# Altium project FABLAB_BADGE_00.PrjPcb
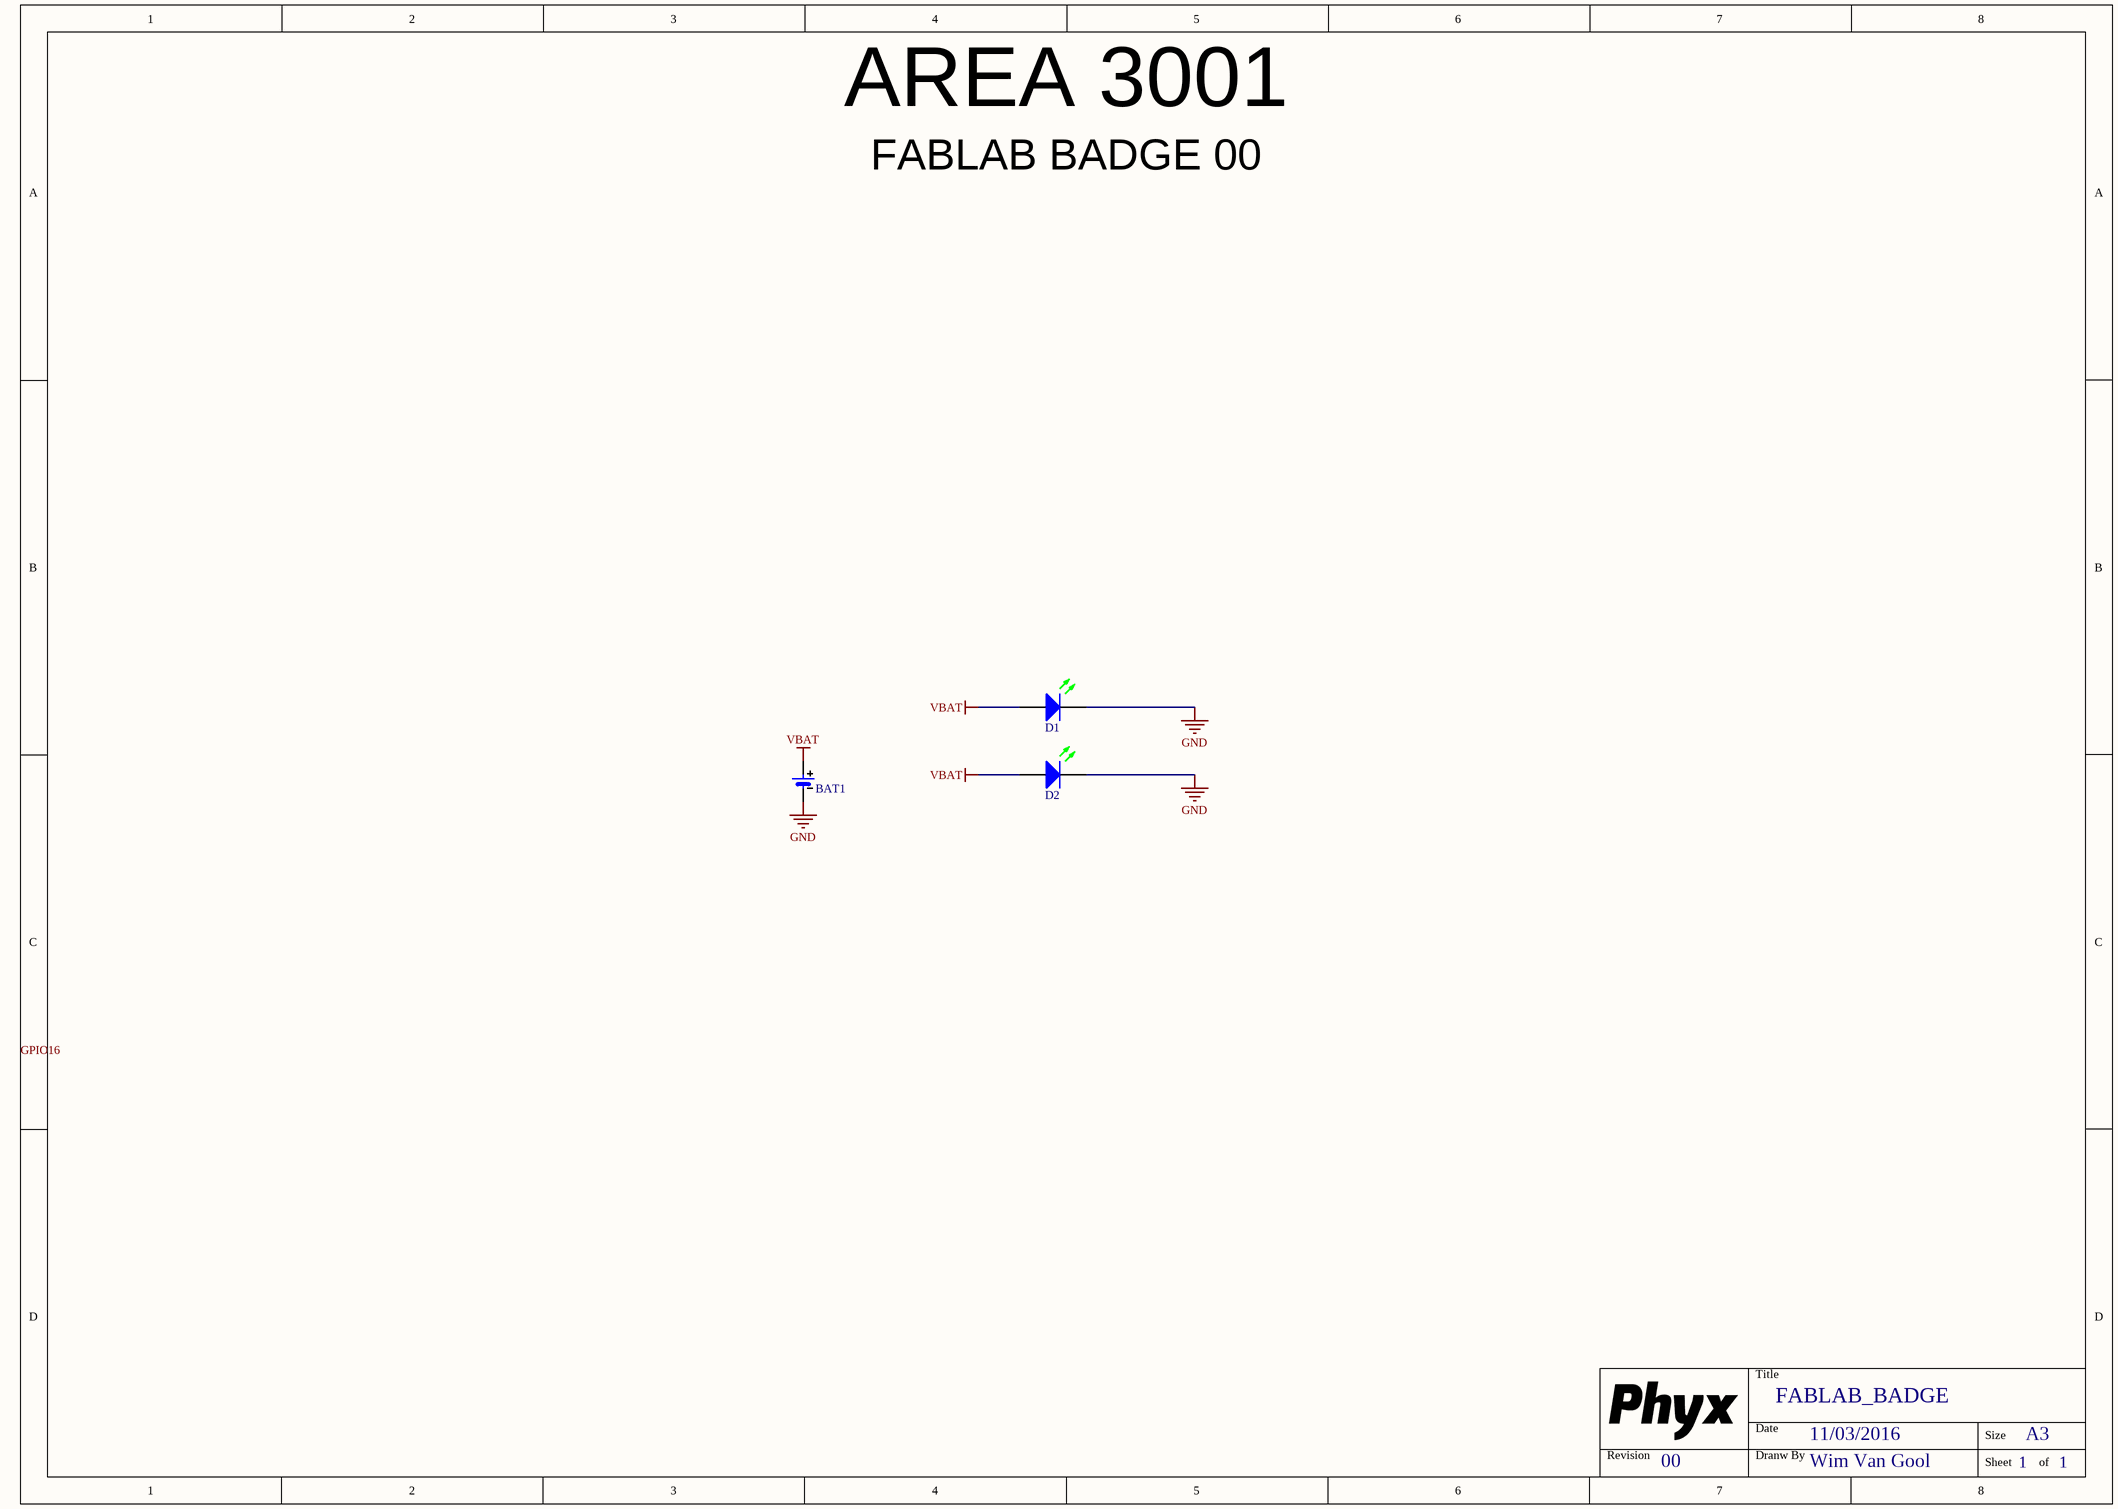
[diagram p0: FABLAB_BADGE_00.SchDoc]
PCB_ENGINEER: WimVG; PCB_REV: 00; PCB_TITLE: FabLab Badge
1 sheet, 3 parts. Net scope: global (net labels, ports and power ports of the same name join across sheets).
Board file: FABLAB_BADGE_00.PcbDoc

## Sheet FABLAB_BADGE_00.SchDoc: FABLAB_BADGE
size A3; Date: 11/03/2016; DrawnBy: Wim Van Gool; Revision: 00; SheetNumber: 1; SheetTotal: 1; PageSetup: Record=PageOptions|CenterHorizontal=True|CenterVertical=True|PrintScale=0.70|XCorrection=1.00|YCorrection=1.00|PrintKind=1|BorderSize=5000000|LeftOffset=0|BottomOffset=0|Orientation=2|PaperLength=1000|PaperWidth=1000|Scale=100|PaperSource=15|PrintQuality=600|MediaType=1|DitherType=10|PrintScaleMode=1|PaperKind=A4 (210 x 297 mm)|PaperIndex=9

### Parts
BAT1  CR2032 Battery Holder  [BAT_CR2032_China]  (value not drawn)
D1  Default 5mm Green LED  [LED_5MM_GR]  (value not drawn)
D2  Default 5mm Green LED  [LED_5MM_GR]  (value not drawn)

### Nets
GND: BAT1.2 D1.2(K) D2.2(K)
VBAT: BAT1.1 D1.1(A) D2.1(A)

### Notes on the sheet
- AREA 3001
- FABLAB BADGE 00
- Title
- Revision
- Date
- Dranw By
- Size
- A3
- Sheet
- of
- Labels drawn without touching a wire or pin: GPIO16

### Library data of the parts
BAT1 = BAT 20mm Coin Cell Holder Genericf: =Description; Description: BAT 20mm Coin Cell Holder Genericf; Value: CR2032; Supplier 1: China
D1 D2 = LED Green 5mm: =Description; Supplier 1: Farnell; Supplier Part Number 1: 2335726